# Altium schematic sheet 17_CAN_BUS.SchDoc
size A3; SheetNumber: 18; SheetTotal: 24
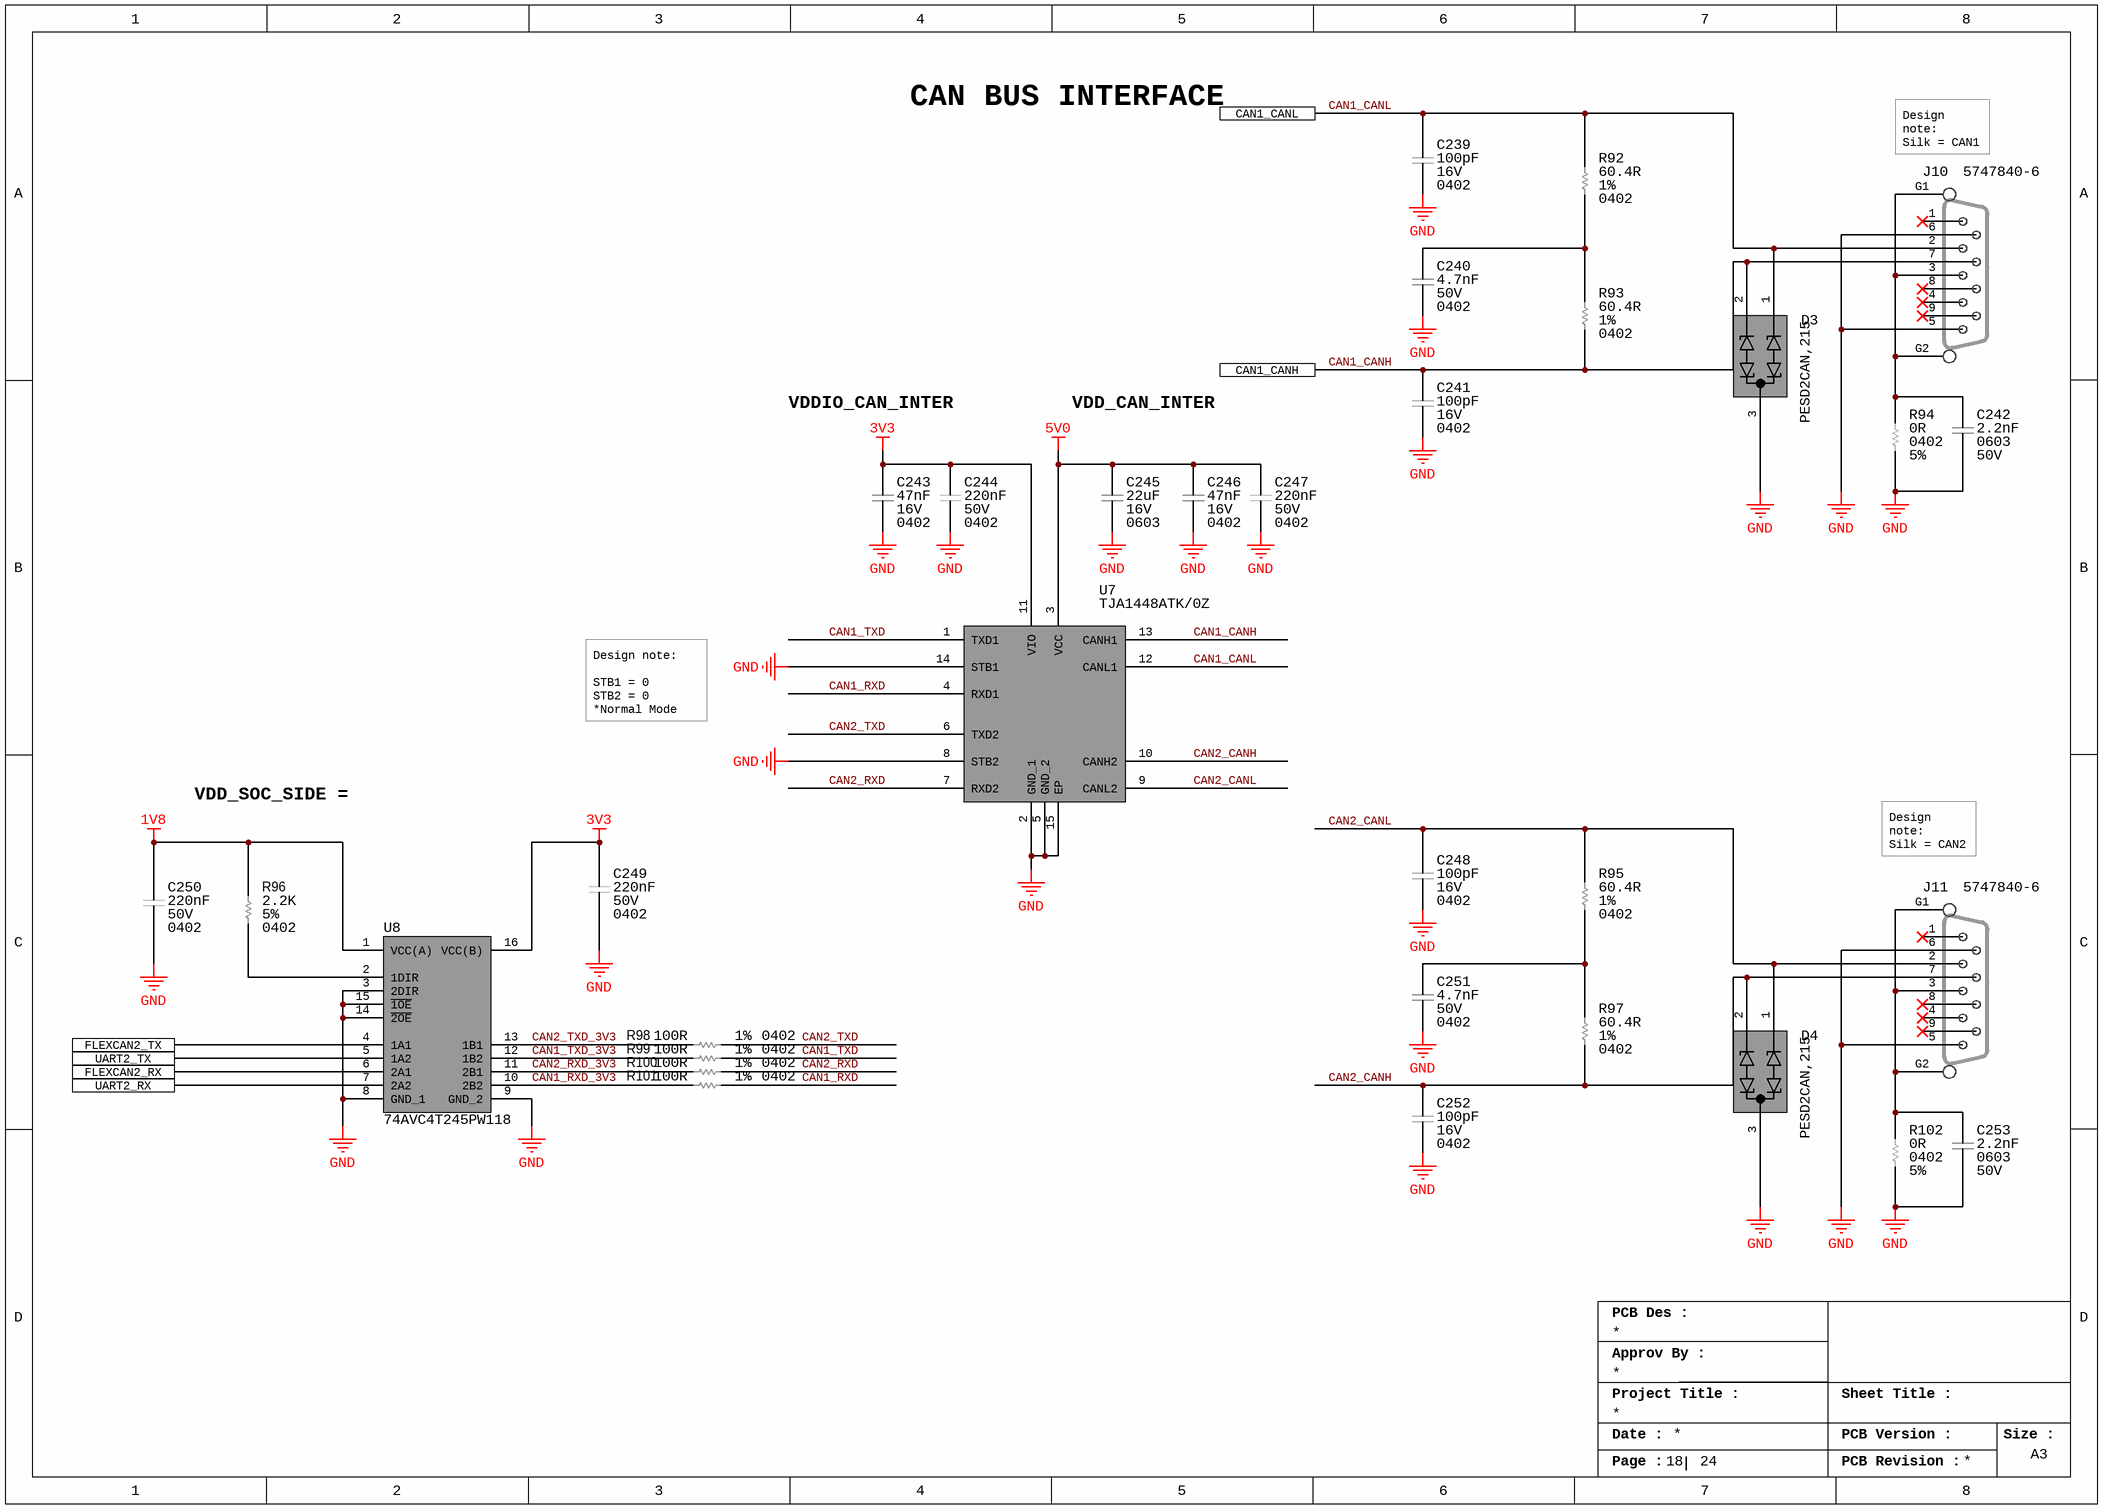
[diagram p0: 17_CAN_BUS.SchDoc]

## Parts
C239  Voltage Rating (DC): 16V  Capacitance: 100pF  Case/Package: 0402  [CAP_0402_CAPC1005X05N]  (hidden comment: CC0402JRNPO7BN101)
C240  Voltage Rating: 50V  Capacitance: 4.7nF  Case/Package: 0402  [CAP_0402_CAPC1005X05N]  (hidden comment: GRM155R61H472KA01D)
C241  Voltage Rating (DC): 16V  Capacitance: 100pF  Case/Package: 0402  [CAP_0402_CAPC1005X05N]  (hidden comment: CC0402JRNPO7BN101)
C242  Case/Package: 0603  Voltage Rating: 50V  Capacitance: 2.2nF  [CAP_0603_CAPC1608X08N]  (hidden comment: GRM1885C1H222JA01D)
C243  Capacitance: 47nF  Voltage Rating: 16V  Case/Package: 0402  [CAP_0402_CAPC1005X05N]  (hidden comment: GCM155R71C473KA37D)
C244  Case/Package: 0402  Voltage Rating (DC): 50V  Capacitance: 220nF  [CAP_0402_CAPC1005X05N]  (hidden comment: GRM155R61H224KE01W)
C245  Capacitance: 22uF  Voltage Rating: 16V  Case/Package: 0603  [CAP_0603_CAPC1608X08N]  (hidden comment: CL10A226MO7JZNC)
C246  Capacitance: 47nF  Voltage Rating: 16V  Case/Package: 0402  [CAP_0402_CAPC1005X05N]  (hidden comment: GCM155R71C473KA37D)
C247  Case/Package: 0402  Voltage Rating (DC): 50V  Capacitance: 220nF  [CAP_0402_CAPC1005X05N]  (hidden comment: GRM155R61H224KE01W)
C248  Voltage Rating (DC): 16V  Capacitance: 100pF  Case/Package: 0402  [CAP_0402_CAPC1005X05N]  (hidden comment: CC0402JRNPO7BN101)
C249  Case/Package: 0402  Voltage Rating (DC): 50V  Capacitance: 220nF  [CAP_0402_CAPC1005X05N]  (hidden comment: GRM155R61H224KE01W)
C250  Case/Package: 0402  Voltage Rating (DC): 50V  Capacitance: 220nF  [CAP_0402_CAPC1005X05N]  (hidden comment: GRM155R61H224KE01W)
C251  Voltage Rating: 50V  Capacitance: 4.7nF  Case/Package: 0402  [CAP_0402_CAPC1005X05N]  (hidden comment: GRM155R61H472KA01D)
C252  Voltage Rating (DC): 16V  Capacitance: 100pF  Case/Package: 0402  [CAP_0402_CAPC1005X05N]  (hidden comment: CC0402JRNPO7BN101)
C253  Case/Package: 0603  Voltage Rating: 50V  Capacitance: 2.2nF  [CAP_0603_CAPC1608X08N]  (hidden comment: GRM1885C1H222JA01D)
D3  PESD2CAN,215  [DIO_PESD2CAN,215]
D4  PESD2CAN,215  [DIO_PESD2CAN,215]
J10  5747840-6  [TE_5747840-6]
J11  5747840-6  [TE_5747840-6]
R92  Tolerance: 1%  Resistance: 60.4R  Case/Package: 0402  [RES_0402_RESC1005X04N]  (hidden comment: RK73H1ETTP60R4F)
R93  Tolerance: 1%  Resistance: 60.4R  Case/Package: 0402  [RES_0402_RESC1005X04N]  (hidden comment: RK73H1ETTP60R4F)
R94  Case Code (Imperial): 0402  Tolerance: 5%  Resistance: 0R  [RES_0402_RESC1005X04N]  (hidden comment: ERJ-2GE0R00X)
R95  Tolerance: 1%  Resistance: 60.4R  Case/Package: 0402  [RES_0402_RESC1005X04N]  (hidden comment: RK73H1ETTP60R4F)
R96  Tolerance: 5%  Resistance: 2.2K  Case/Package: 0402  [RES_0402_RESC1005X04N]  (hidden comment: RC0402JR-072K2L)
R97  Tolerance: 1%  Resistance: 60.4R  Case/Package: 0402  [RES_0402_RESC1005X04N]  (hidden comment: RK73H1ETTP60R4F)
R98  Tolerance: 1%  Resistance: 100R  Case/Package: 0402  [RES_0402_RESC1005X04N]  (hidden comment: ERJ-2RKF1000X)
R99  Tolerance: 1%  Resistance: 100R  Case/Package: 0402  [RES_0402_RESC1005X04N]  (hidden comment: ERJ-2RKF1000X)
R100  Tolerance: 1%  Resistance: 100R  Case/Package: 0402  [RES_0402_RESC1005X04N]  (hidden comment: ERJ-2RKF1000X)
R101  Tolerance: 1%  Resistance: 100R  Case/Package: 0402  [RES_0402_RESC1005X04N]  (hidden comment: ERJ-2RKF1000X)
R102  Case Code (Imperial): 0402  Tolerance: 5%  Resistance: 0R  [RES_0402_RESC1005X04N]  (hidden comment: ERJ-2GE0R00X)
U7  TJA1448ATK/0Z  [SON65P300X450X100-15N]
U8  74AVC4T245PW118  [SOP65P640X110-16N]

## Ports
CAN1_CANH, CAN1_CANL, FLEXCAN2_RX, FLEXCAN2_TX, UART2_RX, UART2_TX

## Nets
1V8: C250.2 R96.2 U8.1(VCC(A))
3V3: C243.2 C244.1 C249.2 U7.11(VIO) U8.16(VCC(B))
5V0: C245.2 C246.2 C247.1 U7.3(VCC)
GND: C239.1 C240.1 C241.1 C242.1 C243.1 C244.2 C245.1 C246.1 C247.2 C248.1 C249.1 C250.1 C251.1 C252.1 C253.1 D3.3(CC) D4.3(CC) J10.5 J10.6 J11.5 J11.6 R94.1 R102.1 U7.2(GND_1) U7.5(GND_2) U7.8(STB2) U7.14(STB1) U7.15(EP) U8.3(2DIR) U8.8(GND_1) U8.9(GND_2) U8.14(~{2OE}) U8.15(~{1OE})
CAN1_CANH: C241.2 D3.2(C2) J10.7 R93.1 U7.13(CANH1) ; port CAN1_CANH
CAN1_CANL: C239.2 D3.1(C1) J10.2 R92.2 U7.12(CANL1) ; port CAN1_CANL
CAN1_RXD: R101.2 U7.4(RXD1)
CAN1_RXD_3V3: R101.1 U8.10(2B2)
CAN1_TXD: R99.2 U7.1(TXD1)
CAN1_TXD_3V3: R99.1 U8.12(1B2)
CAN2_CANH: C252.2 D4.2(C2) J11.7 R97.1 U7.10(CANH2)
CAN2_CANL: C248.2 D4.1(C1) J11.2 R95.2 U7.9(CANL2)
CAN2_RXD: R100.2 U7.7(RXD2)
CAN2_RXD_3V3: R100.1 U8.11(2B1)
CAN2_TXD: R98.2 U7.6(TXD2)
CAN2_TXD_3V3: R98.1 U8.13(1B1)
FLEXCAN2_RX: U8.6(2A1) ; port FLEXCAN2_RX
FLEXCAN2_TX: U8.4(1A1) ; port FLEXCAN2_TX
UART2_RX: U8.7(2A2) ; port UART2_RX
UART2_TX: U8.5(1A2) ; port UART2_TX
NetC240_2: C240.2 R92.1 R93.2
NetC242_2: C242.2 J10.3 J10.G1 J10.G2(G) R94.2
NetC251_2: C251.2 R95.1 R97.2
NetC253_2: C253.2 J11.3 J11.G1 J11.G2(G) R102.2
NetR96_1: R96.1 U8.2(1DIR)

Not connected (* = marked no-connect by the designer): J10 1* 4* 8* 9*; J11 1* 4* 8* 9*

## Notes on the sheet
- CAN BUS INTERFACE
- (near J10) Design note:
  Silk = CAN1
- VDDIO_CAN_INTER = 3V3
- VDD_CAN_INTER = 5V0
- Design note:
  STB1 = 0
  STB2 = 0
  *Normal Mode
- VDD_SOC_SIDE = 1V8
- Design note:
  Silk = CAN2
- PCB Des :
- Approv By :
- Project Title :
- Sheet Title :
- Date :
- PCB Version :
- Size :
- A3
- Page :
- PCB Revision :

## Library data of the parts
C239 C241 C248 C252 = CAP_100PF_16V_NP0_0402: 0402 100 pF 16 V ±5 % Tolerance NP0 SMT Multilayer Ceramic Capacitor; Manufacturer: Yageo; Tolerance: 5%; Supplier 1: Digi-Key; Manufacturer Part Number: CC0402JRNPO7BN101; RoHS: Yes; Category: Ceramic Capacitors; Stock 1: 66004; Pricing 1: 1=0.1, 10=0.024, 50=0.013, 100=0.0107, 500=0.00764, 1000=0.006, 2500=0.00546, 5000=0.00502 (USD); Mount: Surface Mount; Number of Pins: 2; Case Code (Imperial): 0402; Case Code (Metric): 1005; Weight: 2.3E-05oz; Min Operating Temperature: -55°C; Max Operating Temperature: 125°C; Packaging: Tape and Reel; Voltage Rating: 16V; Dielectric: NP0; Termination: SMD/SMT; Series: CC; Length: 0.039inch; Width: 0.02inch; Thickness: 0.022inch; Lead Free: Lead Free; RoHS Compliant: Yes; ComponentLink1URL: http://www.mouser.com/ds/2/447/Yageo_UPY-GP_NP0_16V-to-50V_9-358835.pdf?src-supplier=Mouser; ComponentLink1Description: http://www.mouser.com/ds/2/447/Yageo_UPY-GP_NP0_16V-to-50V_9-358835.pdf?src-supplier=Mouser; ComponentLink2URL: https://datasheet.octopart.com/CC0402JRNPO7BN101-Yageo-datasheet-137700082.pdf?src-supplier=Future+Electronics; ComponentLink2Description: https://datasheet.octopart.com/CC0402JRNPO7BN101-Yageo-datasheet-137700082.pdf?src-supplier=Future+Electronics; ComponentLink3URL: http://www.yageo.com/documents/recent/UPY-GP_NP0_16V-to-50V_9.pdf?src-supplier=Future+Electronics; ComponentLink3Description: http://www.yageo.com/documents/recent/UPY-GP_NP0_16V-to-50V_9.pdf?src-supplier=Future+Electronics; ComponentLink4URL: http://www.yageo.com/exep/pages/download/literatures/ProductSelectionGuide%202014_Final_2.pdf?src-supplier=Digi-Key; ComponentLink4Description: http://www.yageo.com/exep/pages/download/literatures/ProductSelectionGuide%202014_Final_2.pdf?src-supplier=Digi-Key; ComponentLink5URL: https://www.yageo.com/upload/media/product/productsearch/datasheet/mlcc/UPY-GP_NP0_16V-to-50V_18.pdf?src-supplier=Digi-Key; ComponentLink5Description: https://www.yageo.com/upload/media/product/productsearch/datasheet/mlcc/UPY-GP_NP0_16V-to-50V_18.pdf?src-supplier=Digi-Key; ComponentLink6URL: http://www.yageo.com/documents/recent/UPY-GP_NP0_16V-to-50V_16.pdf?src-supplier=Digi-Key; ComponentLink6Description: http://www.yageo.com/documents/recent/UPY-GP_NP0_16V-to-50V_16.pdf?src-supplier=Digi-Key; ComponentLink7URL: https://datasheet.octopart.com/CC0402JRNPO7BN101-Yageo-datasheet-65873193.pdf?src-supplier=Farnell; ComponentLink7Description: https://datasheet.octopart.com/CC0402JRNPO7BN101-Yageo-datasheet-65873193.pdf?src-supplier=Farnell; Supplier Part Number 1: 311-3743-1-ND
C240 C251 = CAP_4700PF_50V_X5R_0402: Multilayer Ceramic Capacitor, 100 uF, 16 V, ± 20%, X5R, 1210 [3225 Metric]; Manufacturer: Murata; Tolerance: 10%; Material: 4241ConductorMaterial; Supplier 1: Digikey; Manufacturer Part Number: GRM155R61H472KA01D; RoHS: Yes; Category: Ceramic Capacitors; Stock 1: 61974; Pricing 1: 1=0.1, 10=0.029, 50=0.0166, 100=0.0129, 500=0.00974, 1000=0.00765, 2500=0.00695, 5000=0.0064 (USD); Mount: Surface Mount; Case Code (Metric): 1005; Case Code (Imperial): 0402; Min Operating Temperature: -55°C; Max Operating Temperature: 85°C; Packaging: Tape and Reel; Package Quantity: 10000; Voltage Rating (DC): 50V; Dielectric: X5R; Termination: SMD/SMT; Series: GRM; Construction: Flat; Length: 1mm; Width: 0.02inch; Height: 0.5mm; Thickness: 0.022inch; Depth: 0.5mm; Radiation Hardening: No; RoHS Compliant: Yes; ComponentLink1URL: https://datasheet.ciiva.com/6263/product-6263668.pdf?src-supplier=Digikey; ComponentLink1Description: https://datasheet.ciiva.com/6263/product-6263668.pdf?src-supplier=Digikey; ComponentLink2URL: https://datasheet.ciiva.com/6263/partnumbering-e-01-6263670.pdf?src-supplier=Digikey; ComponentLink2Description: https://datasheet.ciiva.com/6263/partnumbering-e-01-6263670.pdf?src-supplier=Digikey; ComponentLink3URL: https://datasheet.ciiva.com/11620/product-11620407.pdf?src-supplier=Avnet; ComponentLink3Description: https://datasheet.ciiva.com/11620/product-11620407.pdf?src-supplier=Avnet; ComponentLink4URL: https://datasheet.ciiva.com/6263/partnumbering-e-01-6263672.pdf?src-supplier=Digikey; ComponentLink4Description: https://datasheet.ciiva.com/6263/partnumbering-e-01-6263672.pdf?src-supplier=Digikey; Supplier Part Number 1: 490-6317-1-ND; Supplier 2: Digikey; Stock 2: 503358; Pricing 2: 1=1.73, 10=1.295, 50=1.1816, 100=0.9681 (USD); Reach SVHC Compliant: No; ComponentLink5URL: http://www.farnell.com/datasheets/1497285.pdf?src-supplier=Farnell; ComponentLink5Description: http://www.farnell.com/datasheets/1497285.pdf?src-supplier=Farnell; Supplier Part Number 2: 587-3152-1-ND
C242 C253 = CAP_2.2nF_50V_NP0_0402: Multilayer Ceramic Capacitor, 2200 pF, 50 V, ï¿½ 5%, C0G (NP0), 0603 [1608 Metric]; Manufacturer: Murata; Insulation Resistance: 10GR; Temperature Coefficient: 30ppm/°C; Supplier 1: Digikey; Manufacturer Part Number: GRM1885C1H222JA01D; RoHS: Yes; Category: Ceramic Capacitors; Stock 1: 228613; Pricing 1: 1=0.1, 10=0.045, 50=0.0306, 100=0.0262, 500=0.01882, 1000=0.01654 (USD); Mount: Surface Mount; Number of Pins: 2; Case Code (Imperial): 0603; Case Code (Metric): 1608; Material: Ceramic; Dielectric Material: Ceramic; Min Operating Temperature: -55°C; Max Operating Temperature: 125°C; Tolerance: 5%; Packaging: Tape and Reel; Voltage Rating (DC): 50V; Package Quantity: 1; Dielectric: C0G; Termination: SMD/SMT; Voltage: 50V; Series: GRM; Construction: Flat; Length: 1.6mm; Width: 0.031inch; Height: 0.8mm; Thickness: 0.035inch; Depth: 0.8mm; Reach SVHC Compliant: No; Lead Free: Lead Free; RoHS Compliant: Yes; ComponentLink1URL: https://datasheet.ciiva.com/3777/1632grm1885c1h222ja0123-3777835.pdf?src-supplier=Arrow+Electronics; ComponentLink1Description: https://datasheet.ciiva.com/3777/1632grm1885c1h222ja0123-3777835.pdf?src-supplier=Arrow+Electronics; ComponentLink2URL: https://datasheet.ciiva.com/11786/0900766b807a1cab-11786840.pdf?src-supplier=Rs; ComponentLink2Description: https://datasheet.ciiva.com/11786/0900766b807a1cab-11786840.pdf?src-supplier=Rs; ComponentLink3URL: https://datasheet.ciiva.com/133/partnumbering-e-01-133576.pdf?src-supplier=Digikey; ComponentLink3Description: https://datasheet.ciiva.com/133/partnumbering-e-01-133576.pdf?src-supplier=Digikey; ComponentLink4URL: https://datasheet.ciiva.com/133/partnumbering-e-01-133577.pdf?src-supplier=Digikey; ComponentLink4Description: https://datasheet.ciiva.com/133/partnumbering-e-01-133577.pdf?src-supplier=Digikey; ComponentLink5URL: https://datasheet.ciiva.com/133/partnumbering-e-01-133578.pdf?src-supplier=Digikey; ComponentLink5Description: https://datasheet.ciiva.com/133/partnumbering-e-01-133578.pdf?src-supplier=Digikey; ComponentLink6URL: https://datasheet.ciiva.com/11463/product-11463974.pdf?src-supplier=Avnet; ComponentLink6Description: https://datasheet.ciiva.com/11463/product-11463974.pdf?src-supplier=Avnet; ComponentLink7URL: https://datasheet.ciiva.com/2989/product-2989459.pdf?src-supplier=Avnet; ComponentLink7Description: https://datasheet.ciiva.com/2989/product-2989459.pdf?src-supplier=Avnet; ComponentLink8URL: https://datasheet.ciiva.com/6031/4360-6031797.pdf?src-supplier=Farnell; ComponentLink8Description: https://datasheet.ciiva.com/6031/4360-6031797.pdf?src-supplier=Farnell; ComponentLink9URL: https://datasheet.ciiva.com/7828/4360-7828918.pdf?src-supplier=Element14; ComponentLink9Description: https://datasheet.ciiva.com/7828/4360-7828918.pdf?src-supplier=Element14; ComponentLink10URL: https://datasheet.ciiva.com/7828/1747455-7828919.pdf?src-supplier=Element14; ComponentLink10Description: https://datasheet.ciiva.com/7828/1747455-7828919.pdf?src-supplier=Element14; ComponentLink11URL: https://datasheet.ciiva.com/7828/1747455-7828920.pdf?src-supplier=Element14; ComponentLink11Description: https://datasheet.ciiva.com/7828/1747455-7828920.pdf?src-supplier=Element14; Supplier Part Number 1: 490-1459-1-ND
C243 C246 = CAP_47nF_16V_X7R_0402: Multilayer Ceramic Capacitor, 0.047 uF, 16 V, ± 10%, X7R, 0402 [1005 Metric]; Manufacturer: Murata; Supplier 1: Digikey; Manufacturer Part Number: GCM155R71C473KA37D; RoHS: Yes; Category: Ceramic Capacitors; Stock 1: 500171; Pricing 1: 1=0.1, 10=0.029, 50=0.0192, 100=0.0159, 500=0.01036, 1000=0.00952, 2500=0.00781, 5000=0.00769 (USD); Mount: Surface Mount; Case Code (Metric): 1005; Case Code (Imperial): 0402; Material: Ceramic; Min Operating Temperature: -55°C; Max Operating Temperature: 125°C; Tolerance: 10%; Packaging: Tape and Reel; Package Quantity: 1; Dielectric: X7R; Voltage Rating (DC): 16V; Termination: SMD/SMT; Series: GCM; Construction: Flat; Length: 1mm; Width: 0.02inch; Height: 0.5mm; Thickness: 0.022inch; Depth: 0.5mm; Ratings: AEC-Q200; Radiation Hardening: No; RoHS Compliant: Yes; ComponentLink1URL: https://datasheet.ciiva.com/11607/product-11607786.pdf?src-supplier=Avnet; ComponentLink1Description: https://datasheet.ciiva.com/11607/product-11607786.pdf?src-supplier=Avnet; ComponentLink2URL: https://datasheet.ciiva.com/6270/s0717e-6270764.pdf?src-supplier=Digikey; ComponentLink2Description: https://datasheet.ciiva.com/6270/s0717e-6270764.pdf?src-supplier=Digikey; ComponentLink3URL: https://datasheet.ciiva.com/6270/s0717e-6270765.pdf?src-supplier=Digikey; ComponentLink3Description: https://datasheet.ciiva.com/6270/s0717e-6270765.pdf?src-supplier=Digikey; ComponentLink4URL: https://datasheet.ciiva.com/6270/s0717e-6270766.pdf?src-supplier=Digikey; ComponentLink4Description: https://datasheet.ciiva.com/6270/s0717e-6270766.pdf?src-supplier=Digikey; Supplier Part Number 1: 490-6042-1-ND
C244 C247 C249 C250 = CAP_0.22UF_50V_X5R_0402: Multilayer Ceramic Capacitor, 0.22 uF, 50 VDC, ± 10%, X5R, 0402 [1005 Metric]; Manufacturer: Murata; Material: 4241ConductorMaterial; Dielectric: 1537DielectricType; Supplier 1: Digi-Key; Manufacturer Part Number: GRM155R61H224KE01W; RoHS: No; Category: Ceramic Capacitors; Stock 1: 74638; Pricing 1: 1=0.1, 10=0.048, 50=0.0272, 100=0.0212, 500=0.01592, 1000=0.01251, 2500=0.01138, 5000=0.01046 (USD); Min Operating Temperature: -55°C; Max Operating Temperature: 85°C; Voltage Rating: 50V; Length: 1mm; Width: 500um; Height: 550um; Thickness: 500um; Supplier Part Number 1: 490-GRM155R61H224KE01WCT-ND
C245 = CAP_22UF_16V_X5R_0603: Cap Ceramic 22uF 16V X5R 20% Pad SMD 0603 85C T/R; Manufacturer: Samsung; Supplier 1: Digi-Key; Manufacturer Part Number: CL10A226MO7JZNC; RoHS: Yes; Category: Ceramic Capacitors; Stock 1: 1760065; Pricing 1: 1=0.59, 10=0.419, 50=0.3164, 100=0.2756, 500=0.20418, 1000=0.17355 (USD); Mount: Surface Mount; Case Code (Imperial): 0603; Case Code (Metric): 1608; Min Operating Temperature: -55°C; Max Operating Temperature: 85°C; Packaging: Cut Tape; Tolerance: 20%; Series: CL; RoHS Compliant: Yes; ComponentLink1URL: http://www.samsungsem.com/kr/support/product-search/mlcc/CL10A226MO7JZNC.jsp?src-supplier=Digi-Key; ComponentLink1Description: http://www.samsungsem.com/kr/support/product-search/mlcc/CL10A226MO7JZNC.jsp?src-supplier=Digi-Key; ComponentLink2URL: https://datasheet.octopart.com/CL10A226MO7JZNC-Samsung-Electro-Mechanics-datasheet-149156497.pdf?src-supplier=Future+Electronics; ComponentLink2Description: https://datasheet.octopart.com/CL10A226MO7JZNC-Samsung-Electro-Mechanics-datasheet-149156497.pdf?src-supplier=Future+Electronics; Supplier Part Number 1: 1276-7076-1-ND
D3 D4 = DIO_TVS_41V_5A_PESD2CAN,215: 5A 230W 41V 26.2V Bidirectional 24V SOT-23 ESD and Surge Protection (TVS/ESD) ROHS; Manufacturer: Nexperia; Breakdown Voltage: 30.3V; Number of Channels: 1NUMBER; Supplier 1: Digikey; Manufacturer Part Number: PESD2CAN,215; RoHS: No; Category: TVS Diodes; Stock 1: 144616; Pricing 1: 1=0.37, 10=0.246, 100=0.187, 500=0.148, 1000=0.128, 3000=0.10404 (USD); Number of Pins: 3NUMBER; Direction: Bidirectional; Clamping Voltage: 41V; Peak Pulse Current: 5A; Reverse Standoff Voltage: 24V; Operating Supply Voltage: 24V; Height: 1.1mm; ComponentLink1URL: http://www.farnell.com/datasheets/1750978.pdf?src-supplier=Farnell; ComponentLink1Description: http://www.farnell.com/datasheets/1750978.pdf?src-supplier=Farnell; ComponentLink2URL: https://assets.nexperia.com/documents/data-sheet/PESD2CAN.pdf?src-supplier=Digikey; ComponentLink2Description: https://assets.nexperia.com/documents/data-sheet/PESD2CAN.pdf?src-supplier=Digikey; ComponentLink3URL: http://www.farnell.com/datasheets/1750978.pdf?src-supplier=Newark; ComponentLink3Description: http://www.farnell.com/datasheets/1750978.pdf?src-supplier=Newark; Supplier Part Number 1: 1727-3891-1-ND
J10 J11 = CONN_DB9_TEConnectivity_5747840-6: D Subminiature Connector, 9 Contact(s), Male, 0.108 inch Pitch, Solder Terminal, #4-40, Plug; Gender: 29Gender; Number of Positions: 9NUMBER; Voltage Rating: 125V; Mating Connector Lock: 5962ProductFeature; PCB Mount Retention: 5953PCBMountRetention; Sealable: 5964ProductFeature; Current Rating: 6A; Circuit Application: 5778ConnectorType; Row Spacing: 2.8448mm; Supplier 1: Digikey; Manufacturer: TE Connectivity; Manufacturer Part Number: 5747840-6; RoHS: Yes; Category: D-Sub Connectors; Stock 1: 5638; Pricing 1: 1=4.92, 10=4.183, 25=3.9212, 50=3.7338, 130=3.49023, 260=3.32365, 520=3.1651, 1040=3.01412, 2600=2.82563 (USD); Mount: 9Mount; Number of Pins: 9NUMBER; Contact Material: 152ConductorMaterial; Contact Plating: 154,157ConductorMaterial; Material: 155ConductorMaterial; Contact Shape: 4456Shape; Housing Color: 46Colour; Housing Material: 4261ConductorMaterial; Color: 46Colour; Min Operating Temperature: -55°C; Max Operating Temperature: 105°C; Orientation: 5492OrientationType; Number of Contacts: 9NUMBER; Number of Rows: 2NUMBER; Height: 12.93mm; Lead Free: 5697LeadFree; ComponentLink1URL: https://datasheet.octopart.com/5747840-6-Tyco-Electronics-datasheet-5319747.pdf?src-supplier=Farnell; ComponentLink1Description: https://datasheet.octopart.com/5747840-6-Tyco-Electronics-datasheet-5319747.pdf?src-supplier=Farnell; ComponentLink2URL: https://datasheet.octopart.com/5747840-6-TE-Connectivity---AMP-datasheet-65569592.pdf?src-supplier=Newark; ComponentLink2Description: https://datasheet.octopart.com/5747840-6-TE-Connectivity---AMP-datasheet-65569592.pdf?src-supplier=Newark; ComponentLink3URL: https://datasheet.octopart.com/5747840-6-Tyco-Electronics-datasheet-11086102.pdf?src-supplier=Verical; ComponentLink3Description: https://datasheet.octopart.com/5747840-6-Tyco-Electronics-datasheet-11086102.pdf?src-supplier=Verical; ComponentLink4URL: https://datasheet.octopart.com/5747840-6-Tyco-Electronics-datasheet-5315872.pdf?src-supplier=Electro+Sonic; ComponentLink4Description: https://datasheet.octopart.com/5747840-6-Tyco-Electronics-datasheet-5315872.pdf?src-supplier=Electro+Sonic; Supplier Part Number 1: A32094-ND
R92 R93 R95 R97 = RES_60.4R_1%_100mW_0402: Res Thick Film 0402 60.4 Ohm 1% 0.1W(1/10W) ±100ppm/C Pad SMD Automotive T/R; Manufacturer: KOA Speer; Power Rating: 63mW; Voltage Rating: 50V; Temperature Coefficient: 100ppm/°C; Max Power Dissipation: 100mW; Supplier 1: Digikey; Manufacturer Part Number: RK73H1ETTP60R4F; RoHS: Yes; Category: Chip SMD Resistors; Stock 1: 72753; Pricing 1: 1=0.1, 10=0.027, 100=0.0129, 1000=0.00713, 2500=0.00585, 5000=0.00544 (USD); Mount: Surface Mount; Case Code (Imperial): 0402; Case Code (Metric): 1005; Min Operating Temperature: -55°C; Max Operating Temperature: 155°C; Packaging: Tape and Reel; Package Quantity: 10000; Termination: SMD/SMT; Voltage Rating (DC): 50V; Series: RK73H; Construction: Rectangular; Technology: THICK FILM; Features: Moisture Resistant,Automotive AEC-Q200; Number of Terminations: 2; Length: 1mm; Width: 0.5mm; Height: 0.35mm; Depth: 0.5mm; Ratings: AEC-Q200; Military Standard: Not; RoHS Compliant: Yes; ComponentLink1URL: https://datasheet.ciiva.com/5555/rk73h-5555837.pdf?src-supplier=Mouser; ComponentLink1Description: https://datasheet.ciiva.com/5555/rk73h-5555837.pdf?src-supplier=Mouser; Supplier Part Number 1: 2019-RK73H1ETTP60R4FCT-ND
R94 R102 = RES_0R_5%_100mW_0402: SMD Chip Resistor, Jumper, 0 ohm, 100 mW, 0402 [1005 Metric], Thick Film, General Purpose; Manufacturer: Panasonic; Power Rating: 100mW; Voltage Rating: 50V; Temperature Coefficient: 600ppm/°C; Supplier 1: Mouser; Manufacturer Part Number: ERJ-2GE0R00X; RoHS: Yes; Category: Chip SMD Resistors; Stock 1: 10989354; Pricing 1: 1=0.1, 10=0.013, 50=0.013, 100=0.006, 1000=0.004, 2500=0.003, 10000=0.003 (USD); Mount: Surface Mount; Case/Package: 0402; Contact Plating: Tin; Case Code (Metric): 1005; Size Code: 0402; Min Operating Temperature: -55°C; Max Operating Temperature: 155°C; Resistor Type: Thick Film; Packaging: Cut Tape; Package Quantity: 10000; Number of Terminations: 2; Termination: SMD/SMT; Max Power Dissipation: 100mW; Voltage Rating (DC): 50V; Features: Automotive AEC-Q200; Series: ERJ; Construction: Rectangular; Technology: THICK FILM; Length: 1mm; Width: 0.5mm; Height: 0.35mm; Depth: 0.5mm; Ratings: AEC-Q200; Radiation Hardening: No; Reach SVHC Compliant: No; Military Standard: Not; Lead Free: Lead Free; RoHS Compliant: Yes; ComponentLink1URL: https://datasheet.ciiva.com/11821/0900766b80f806dd-11821176.pdf?src-supplier=Rs; ComponentLink1Description: https://datasheet.ciiva.com/11821/0900766b80f806dd-11821176.pdf?src-supplier=Rs; ComponentLink2URL: https://datasheet.ciiva.com/43460/1678796-43460347.pdf?src-supplier=Farnell; ComponentLink2Description: https://datasheet.ciiva.com/43460/1678796-43460347.pdf?src-supplier=Farnell; ComponentLink3URL: https://datasheet.ciiva.com/46389/1678796-46389518.pdf?src-supplier=Element14; ComponentLink3Description: https://datasheet.ciiva.com/46389/1678796-46389518.pdf?src-supplier=Element14; ComponentLink4URL: https://datasheet.ciiva.com/5959/1678796-5959692.pdf?src-supplier=Farnell; ComponentLink4Description: https://datasheet.ciiva.com/5959/1678796-5959692.pdf?src-supplier=Farnell; ComponentLink5URL: https://datasheet.ciiva.com/28695/1678796-28695758.pdf?src-supplier=Element14; ComponentLink5Description: https://datasheet.ciiva.com/28695/1678796-28695758.pdf?src-supplier=Element14; ComponentLink6URL: https://datasheet.ciiva.com/16783/70260739-16783734.pdf?src-supplier=Allied+Electronics; ComponentLink6Description: https://datasheet.ciiva.com/16783/70260739-16783734.pdf?src-supplier=Allied+Electronics; ComponentLink7URL: https://datasheet.ciiva.com/16778/70260739-16778335.pdf?src-supplier=Allied+Electronics; ComponentLink7Description: https://datasheet.ciiva.com/16778/70260739-16778335.pdf?src-supplier=Allied+Electronics; ComponentLink8URL: https://datasheet.ciiva.com/48531/aoa0000ce1-48531077.pdf?src-supplier=Avnet; ComponentLink8Description: https://datasheet.ciiva.com/48531/aoa0000ce1-48531077.pdf?src-supplier=Avnet; ComponentLink9URL: https://datasheet.ciiva.com/30097/4aoa0000ce1-30097116.pdf?src-supplier=Onlinecomponents.com; ComponentLink9Description: https://datasheet.ciiva.com/30097/4aoa0000ce1-30097116.pdf?src-supplier=Onlinecomponents.com; Supplier Part Number 1: 667-ERJ-2GE0R00X
R96 = RES_2.2K_5%_63mW_0402: SMD Chip Resistor, 2.2 kOhm, ± 5%, 63 mW, 0402 [1005 Metric], Thick Film, General Purpose; Manufacturer: Yageo; Power Rating: 62.5mW; Voltage Rating: 50V; Temperature Coefficient: 100ppm/°C; Max Power Dissipation: 63mW; Supplier 1: Mouser; Manufacturer Part Number: RC0402JR-072K2L; RoHS: Yes; Category: Chip SMD Resistors; Stock 1: 27488; Pricing 1: 1=0.1, 10=0.011, 50=0.011, 100=0.006, 1000=0.005, 10000=0.002 (USD); Case Code (Metric): 1005; Case Code (Imperial): 0402; Weight: 2.3E-05oz; Min Operating Temperature: -55°C; Max Operating Temperature: 155°C; Package Quantity: 1; Packaging: Tape and Reel; Resistor Type: Thick Film; Number of Terminations: 2; Termination: SMD/SMT; Working Voltage: 50V; Features: Moisture Resistant; Series: RC; Resistance Tolerance: 5%; Construction: Rectangular; Technology: THICK FILM; Voltage Rating (AC): 50V; Length: 1mm; Width: 0.02inch; Height: 0.016inch; Depth: 0.5mm; Reach SVHC Compliant: No; Military Standard: Not; RoHS Compliant: Yes; Lead Free: 5697LeadFree; ComponentLink1URL: https://datasheet.ciiva.com/2518/pyu-r-int-thick-7-2518881.pdf?src-supplier=Digikey; ComponentLink1Description: https://datasheet.ciiva.com/2518/pyu-r-int-thick-7-2518881.pdf?src-supplier=Digikey; ComponentLink2URL: https://datasheet.ciiva.com/2518/pyu-r-int-thick-7-2518882.pdf?src-supplier=Digikey; ComponentLink2Description: https://datasheet.ciiva.com/2518/pyu-r-int-thick-7-2518882.pdf?src-supplier=Digikey; ComponentLink3URL: https://datasheet.ciiva.com/2518/pyu-r-int-thick-7-2518880.pdf?src-supplier=Digikey; ComponentLink3Description: https://datasheet.ciiva.com/2518/pyu-r-int-thick-7-2518880.pdf?src-supplier=Digikey; ComponentLink4URL: https://datasheet.ciiva.com/12577/pyu-rc0402-51-rohs-l-6-r-12577433.pdf?src-supplier=Mouser; ComponentLink4Description: https://datasheet.ciiva.com/12577/pyu-rc0402-51-rohs-l-6-r-12577433.pdf?src-supplier=Mouser; ComponentLink5URL: https://datasheet.ciiva.com/7850/1018594-7850191.pdf?src-supplier=Element14; ComponentLink5Description: https://datasheet.ciiva.com/7850/1018594-7850191.pdf?src-supplier=Element14; ComponentLink6URL: https://datasheet.ciiva.com/7850/1018594-7850190.pdf?src-supplier=Element14; ComponentLink6Description: https://datasheet.ciiva.com/7850/1018594-7850190.pdf?src-supplier=Element14; ComponentLink7URL: https://datasheet.ciiva.com/16741/pyu-rc0402-51-rohs-l-6-r-16741086.pdf?src-supplier=Future+Electronics; ComponentLink7Description: https://datasheet.ciiva.com/16741/pyu-rc0402-51-rohs-l-6-r-16741086.pdf?src-supplier=Future+Electronics; ComponentLink8URL: https://datasheet.ciiva.com/15189/getdatasheetpartid-327800-15189558.pdf?src-supplier=Verical; ComponentLink8Description: https://datasheet.ciiva.com/15189/getdatasheetpartid-327800-15189558.pdf?src-supplier=Verical; Supplier Part Number 1: 603-RC0402JR-072K2L
R98-R101 = RES_100R_1%_100mW_0402: Resistor Thick Film 0402 100 Ohm 1% 1/10W 100ppm/C Molded SMD Punched Carrier T/R; Manufacturer: Panasonic; Temperature Coefficient: 100ppm/°C; Power Rating: 100mW; Voltage Rating: 50V; Supplier 1: Mouser; Manufacturer Part Number: ERJ-2RKF1000X; RoHS: Yes; Category: Chip SMD Resistors; Stock 1: 10699571; Pricing 1: 1=0.1, 10=0.015, 50=0.015, 100=0.009, 1000=0.006, 10000=0.004 (USD); Mount: Surface Mount; Number of Pins: 2; Contact Plating: Tin; Case Code (Imperial): 0402; Case Code (Metric): 1005; Size Code: 0402; Min Operating Temperature: -55°C; Max Operating Temperature: 155°C; Resistor Type: Thick Film; Packaging: Tape and Reel; Package Quantity: 1; Termination: SMD/SMT; Number of Terminations: 2; Max Power Dissipation: 100mW; Voltage Rating (DC): 50V; Features: Automotive AEC-Q200; Series: ERJ; Technology: THICK FILM; Resistance Tolerance: 1%; Construction: Rectangular; Length: 1mm; Width: 0.5mm; Height: 0.35mm; Depth: 0.5mm; Radiation Hardening: No; Reach SVHC Compliant: No; Military Standard: Not; Lead Free: Lead Free; RoHS Compliant: Yes; ComponentLink1URL: https://datasheet.ciiva.com/27056/2007311-27056035.pdf?src-supplier=Jameco; ComponentLink1Description: https://datasheet.ciiva.com/27056/2007311-27056035.pdf?src-supplier=Jameco; ComponentLink2URL: https://datasheet.ciiva.com/11821/0900766b80f80784-11821173.pdf?src-supplier=Rs; ComponentLink2Description: https://datasheet.ciiva.com/11821/0900766b80f80784-11821173.pdf?src-supplier=Rs; ComponentLink3URL: https://datasheet.ciiva.com/7830/426256-7830973.pdf?src-supplier=Element14; ComponentLink3Description: https://datasheet.ciiva.com/7830/426256-7830973.pdf?src-supplier=Element14; ComponentLink4URL: https://datasheet.ciiva.com/43467/1678782-43467223.pdf?src-supplier=Farnell; ComponentLink4Description: https://datasheet.ciiva.com/43467/1678782-43467223.pdf?src-supplier=Farnell; ComponentLink5URL: https://datasheet.ciiva.com/28514/1678782-28514175.pdf?src-supplier=Element14; ComponentLink5Description: https://datasheet.ciiva.com/28514/1678782-28514175.pdf?src-supplier=Element14; ComponentLink6URL: https://datasheet.ciiva.com/46372/1678782-46372741.pdf?src-supplier=Element14; ComponentLink6Description: https://datasheet.ciiva.com/46372/1678782-46372741.pdf?src-supplier=Element14; ComponentLink7URL: https://datasheet.ciiva.com/16776/70260748-16776427.pdf?src-supplier=Allied+Electronics; ComponentLink7Description: https://datasheet.ciiva.com/16776/70260748-16776427.pdf?src-supplier=Allied+Electronics; ComponentLink8URL: https://datasheet.ciiva.com/9186/aoa0000ce2-9186683.pdf?src-supplier=Avnet; ComponentLink8Description: https://datasheet.ciiva.com/9186/aoa0000ce2-9186683.pdf?src-supplier=Avnet; ComponentLink9URL: https://datasheet.ciiva.com/16199/aoa0000ce2-16199575.pdf?src-supplier=Future+Electronics; ComponentLink9Description: https://datasheet.ciiva.com/16199/aoa0000ce2-16199575.pdf?src-supplier=Future+Electronics; ComponentLink10URL: https://datasheet.ciiva.com/48531/aoa0000ce2-48531067.pdf?src-supplier=Avnet; ComponentLink10Description: https://datasheet.ciiva.com/48531/aoa0000ce2-48531067.pdf?src-supplier=Avnet; ComponentLink11URL: https://datasheet.ciiva.com/30260/aoa0000ce2-30260809.pdf?src-supplier=Onlinecomponents.com; ComponentLink11Description: https://datasheet.ciiva.com/30260/aoa0000ce2-30260809.pdf?src-supplier=Onlinecomponents.com; Supplier Part Number 1: 667-ERJ-2RKF1000X
U7 = IC_TRANSCEIVER_CAN_TJA1448ATK/0Z: Can Transceiver with Standby Mode Dual High-Speed 5Mbps 4.5V to 5.5V 14-Pin HVSON; Manufacturer: NXP Semiconductors; Supplier 1: Digikey; Manufacturer Part Number: TJA1448ATK/0Z; RoHS: No; Category: Interface ICs; Stock 1: 7655; Pricing 1: 1=2.34, 10=1.736, 25=1.5852, 100=1.419, 250=1.33972, 500=1.29196, 1000=1.25262, 2500=1.2111 (USD); Supplier Part Number 1: 568-TJA1448ATK/0ZDKR-ND
U8 = IC_TRANSLATION_TXRX_74AVC4T245PW118: 74Avc4T245Pw/Sot403/Tssop16 Rohs Compliant: Yes |Nexperia 74AVC4T245PW 118; Supplier 1: Digikey; Manufacturer: Nexperia; Manufacturer Part Number: 74AVC4T245PW118; RoHS: No; Category: Voltage Level Shifters; Stock 1: 28980; Pricing 1: 1=0.78, 10=0.56, 25=0.5032, 100=0.4413, 250=0.41172, 500=0.39388, 1000=0.39004, 2500=0.36372, 5000=0.35439, 7500=0.34972, 12500=0.34454, 17500=0.34151, 25000=0.3386 (USD); ComponentLink1URL: https://datasheet.octopart.com/74AVC4T245PW%2C118-Nexperia-datasheet-166679598.pdf?src-supplier=TME; ComponentLink1Description: https://datasheet.octopart.com/74AVC4T245PW%2C118-Nexperia-datasheet-166679598.pdf?src-supplier=TME; Supplier Part Number 1: 1727-6573-1-ND